# EAGLE design hsusb-ft232h-wing-bus-powered (EAGLE 5.10)
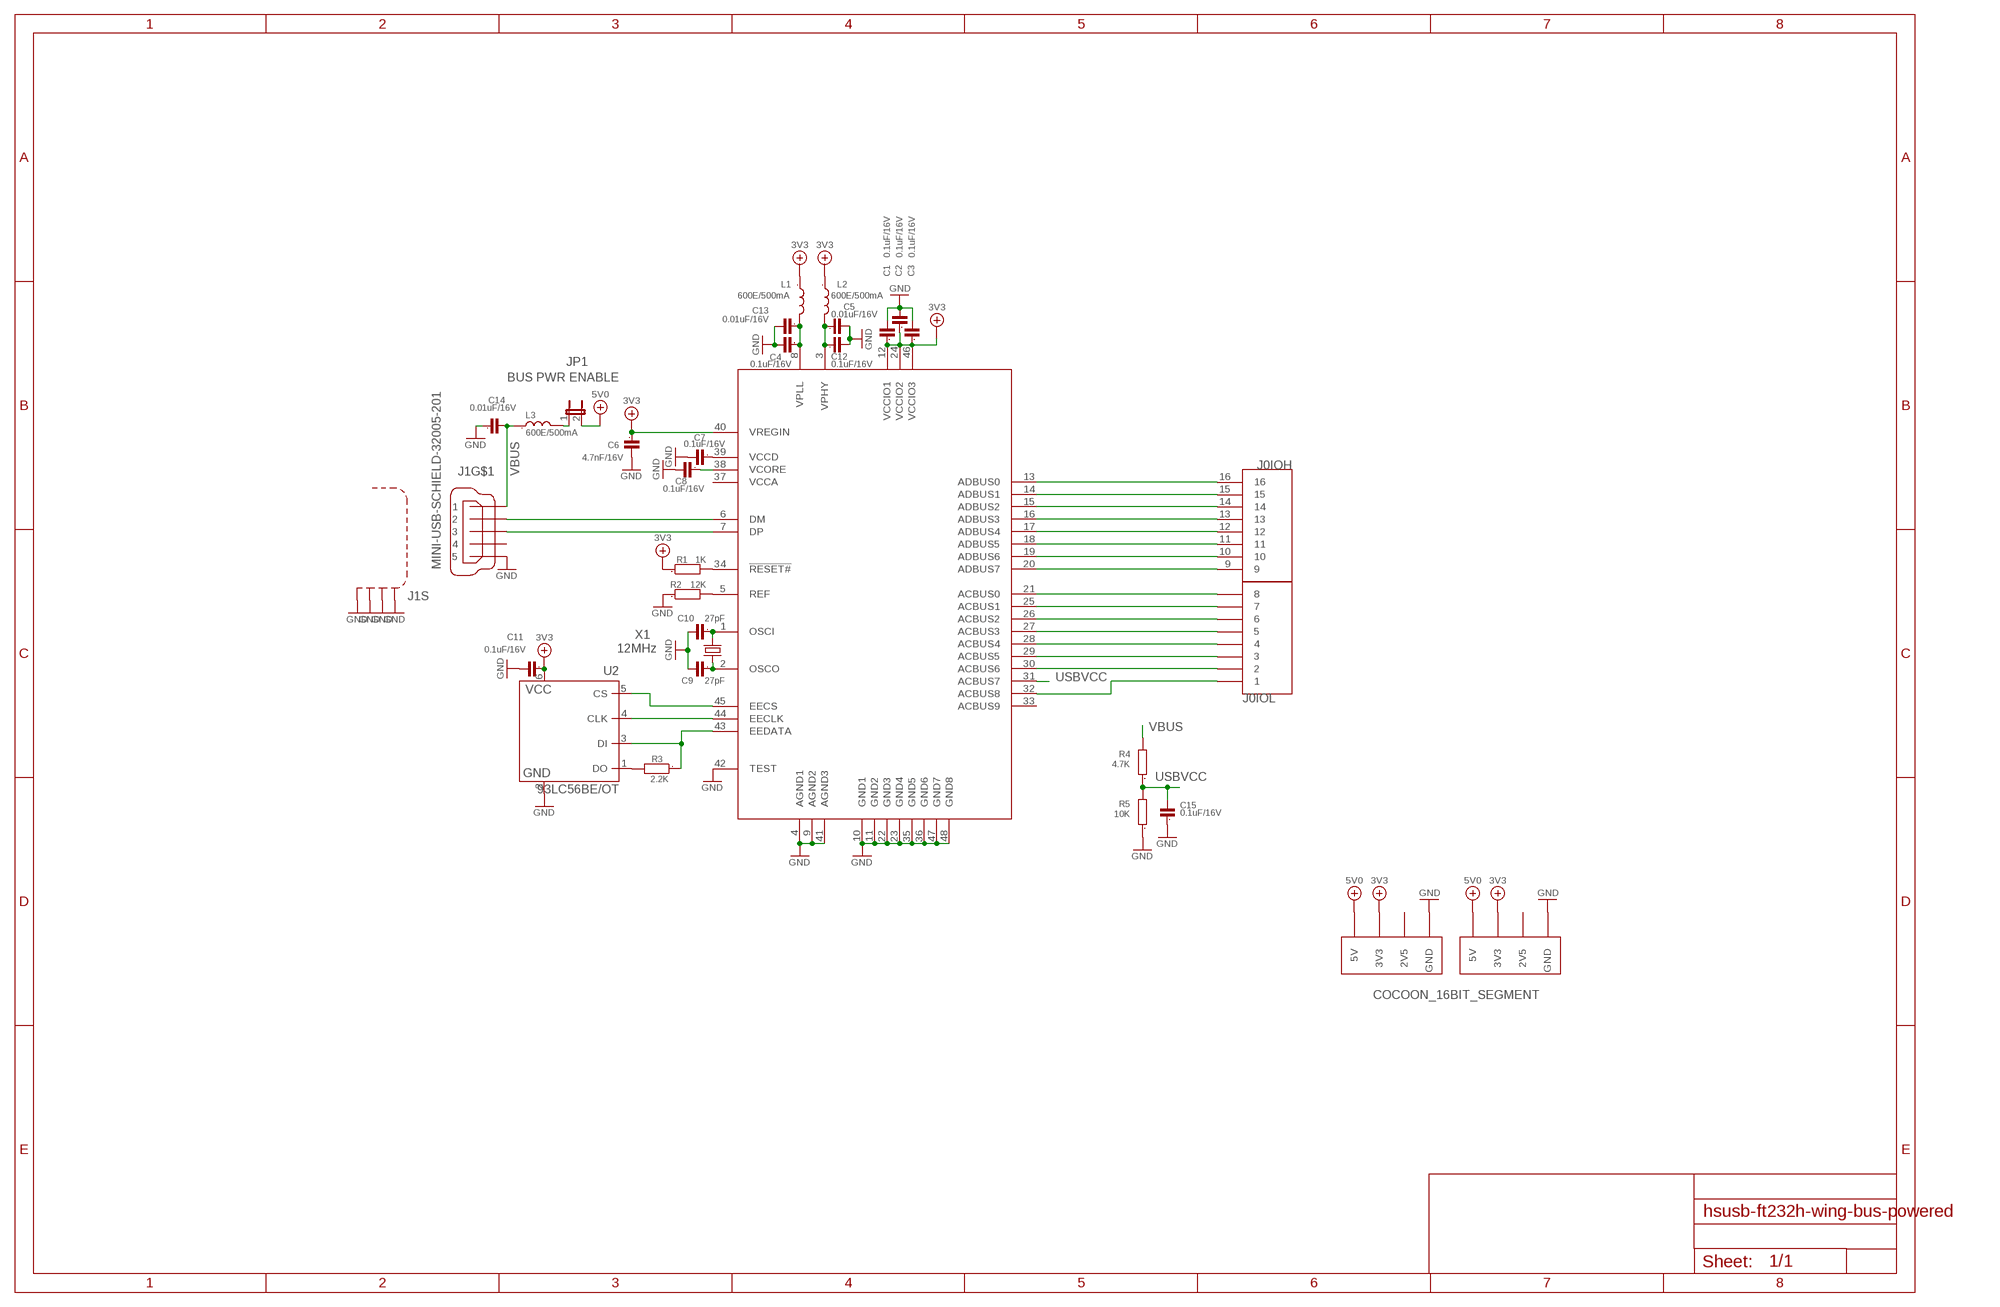
[diagram p0: schematic, sheet 1]

## Parts
C1  0.1uF/16V  C0603  [0603]
C2  0.1uF/16V  C0603  [0603]
C3  0.1uF/16V  C0603  [0603]
C4  0.1uF/16V  C0603  [0603]
C5  0.01uF/16V  C0603  [0603]
C6  4.7nF/16V  C0603  [0603]
C7  0.1uF/16V  C0603  [0603]
C8  0.1uF/16V  C0603  [0603]
C9  27pF  C0603  [0603]
C10  27pF  C0603  [0603]
C11  0.1uF/16V  C0603  [0603]
C12  0.1uF/16V  C0603  [0603]
C13  0.01uF/16V  C0603  [0603]
C14  0.01uF/16V  C0603  [0603]
C15  0.1uF/16V  C0603  [0603]
J0  COCOON_16BIT_SEGMENT  [COCOON_16BIT_SEGMENT]
J1  MINI-USB-SCHIELD-32005-201  [32005-201]
JP1  BUS PWR ENABLE  JP1E  [JP1]
L1  600E/500mA  L0805  [0805]
L2  600E/500mA  L0805  [0805]
L3  600E/500mA  L0805  [0805]
R1  1K  R0603  [0603]
R2  12K  R0603  [0603]
R3  2.2K  R0603  [0603]
R4  4.7K  R0603  [0603]
R5  10K  R0603  [0603]
U1  FT232HL  [LQFP48]
U2  93LC56BE/OT  [SOT23-6]
X1  12MHz  CRYSTALHC49S  [HC49/S]

## Nets
3V3: C1.1 C2.1 C3.1 C6.1 C11.1 J0.3V3(PWRH:3V3) J0.3V3_1(PWRL:3V3) L1.1 L2.1 R1.1 U1.12(VCCIO1) U1.24(VCCIO2) U1.40(VREGIN) U1.46(VCCIO3) U2.6(VCC)
5V0: J0.5V(PWRH:5V) J0.5V_1(PWRL:5V) JP1.2
GND: C1.2 C2.2 C3.2 C4.2 C5.2 C6.2 C7.2 C8.2 C9.2 C10.2 C11.2 C12.2 C13.2 C14.1 C15.1 J0.GND(PWRH:GND) J0.GND_1(PWRL:GND) J1.5 J1.M1(S:S1) J1.M2(S:S2) J1.M3(S:S3) J1.M4(S:S4) R2.1 R5.1 U1.4(AGND1) U1.9(AGND2) U1.10(GND1) U1.11(GND2) U1.22(GND3) U1.23(GND4) U1.35(GND5) U1.36(GND6) U1.41(AGND3) U1.42(TEST) U1.47(GND7) U1.48(GND8) U2.2(GND)
N$1 [HDUSB]: J1.2 U1.6(DM)
N$2 [HDUSB]: J1.3 U1.7(DP)
N$3: J0.9 U1.20(ADBUS7)
N$4: J0.10 U1.19(ADBUS6)
N$5: J0.11 U1.18(ADBUS5)
N$6: J0.12 U1.17(ADBUS4)
N$7: J0.13 U1.16(ADBUS3)
N$8: J0.14 U1.15(ADBUS2)
N$9: J0.15 U1.14(ADBUS1)
N$10: J0.16 U1.13(ADBUS0)
N$11: J0.1 U1.32(ACBUS8)
N$12: J0.2 U1.30(ACBUS6)
N$13: J0.3 U1.29(ACBUS5)
N$14: J0.4 U1.28(ACBUS4)
N$15: J0.5 U1.27(ACBUS3)
N$16: J0.6 U1.26(ACBUS2)
N$17: J0.7 U1.25(ACBUS1)
N$18: J0.8 U1.21(ACBUS0)
N$19: C4.1 C13.1 L1.2 U1.8(VPLL)
N$20: C5.1 C12.1 L2.2 U1.3(VPHY)
N$21: U1.45(EECS) U2.5(CS)
N$22: U1.44(EECLK) U2.4(CLK)
N$23: R3.1 U1.43(EEDATA) U2.3(DI)
N$24: JP1.1 L3.2
N$25: C7.1 U1.39(VCCD)
N$26: C8.1 U1.38(VCORE)
N$27: R3.2 U2.1(DO)
N$28: C10.1 U1.1(OSCI) X1.2
N$29: C9.1 U1.2(OSCO) X1.1
N$30: R1.2 U1.34(!RESET#)
N$31: R2.2 U1.5(REF)
USBVCC: C15.2 R4.1 R5.2 U1.31(ACBUS7)
VBUS: C14.2 J1.1 L3.1 R4.2
Unconnected: J1.4 U1.33(ACBUS9) U1.37(VCCA)

## Power pins joined to a net without a drawn wire
2V5: J0.2V5(PWRH:2V5) J0.2V5_1(PWRL:2V5)

## Library data of the parts
C1-C15 = GadgetFactory:C: CAPACITOR, European symbol
J0 = GadgetFactory_Pub6:COCOON_16BIT_SEGMENT
J1 = con-cypressindustries:MINI-USB-SCHIELD-: MINI USB-B Conector Source: www.cypressindustries.com
JP1 = usb1:JP1E: JUMPER
L1-L3 = GadgetFactory:L: INDUCTOR, European symbol
R1-R5 = GadgetFactory:R: RESISTOR, European symbol
U1 = usb1:FT232H
U2 = usb1:93LC56B
X1 = usb1:CRYSTAL: CRYSTAL

## Net classes
1 HDUSB: width 0.203 mm, clearance 0.635 mm

## Board
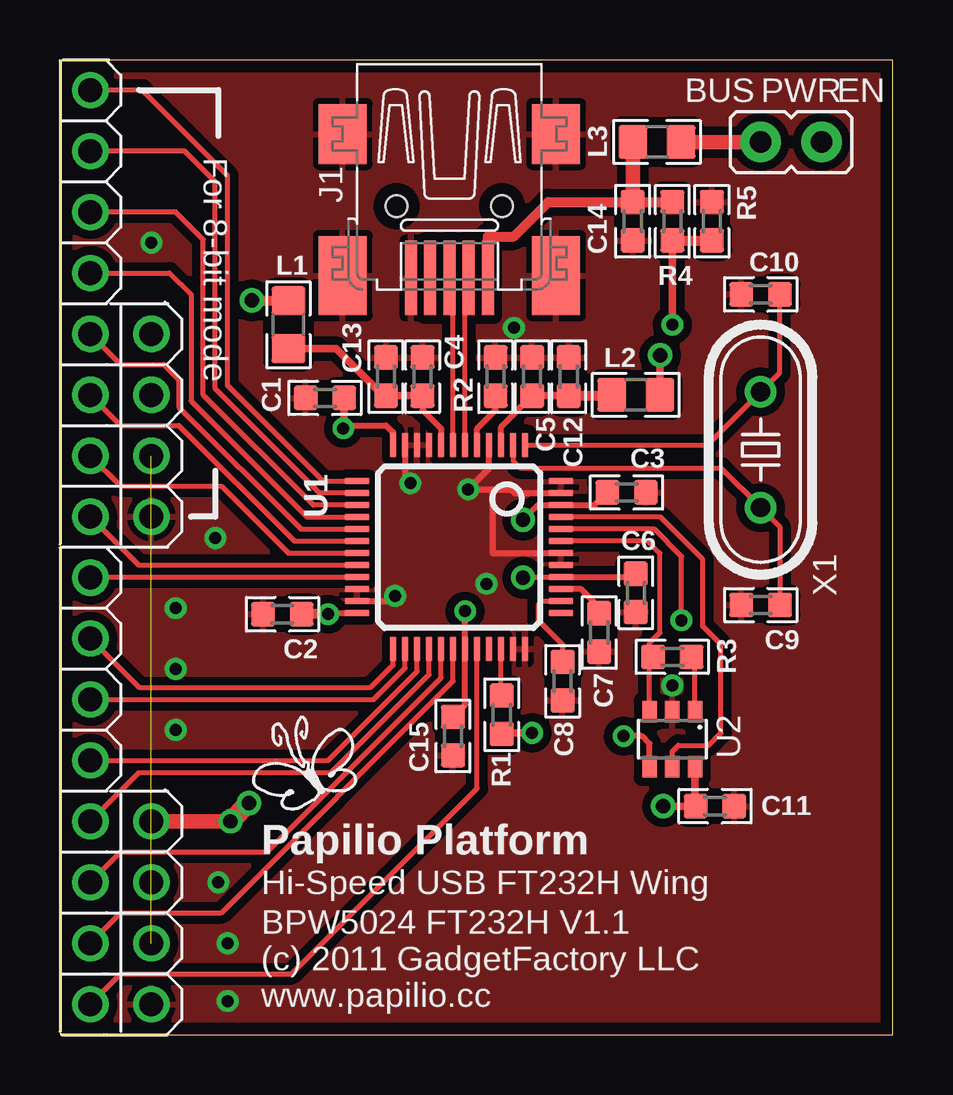
[diagram p1: board, top side]
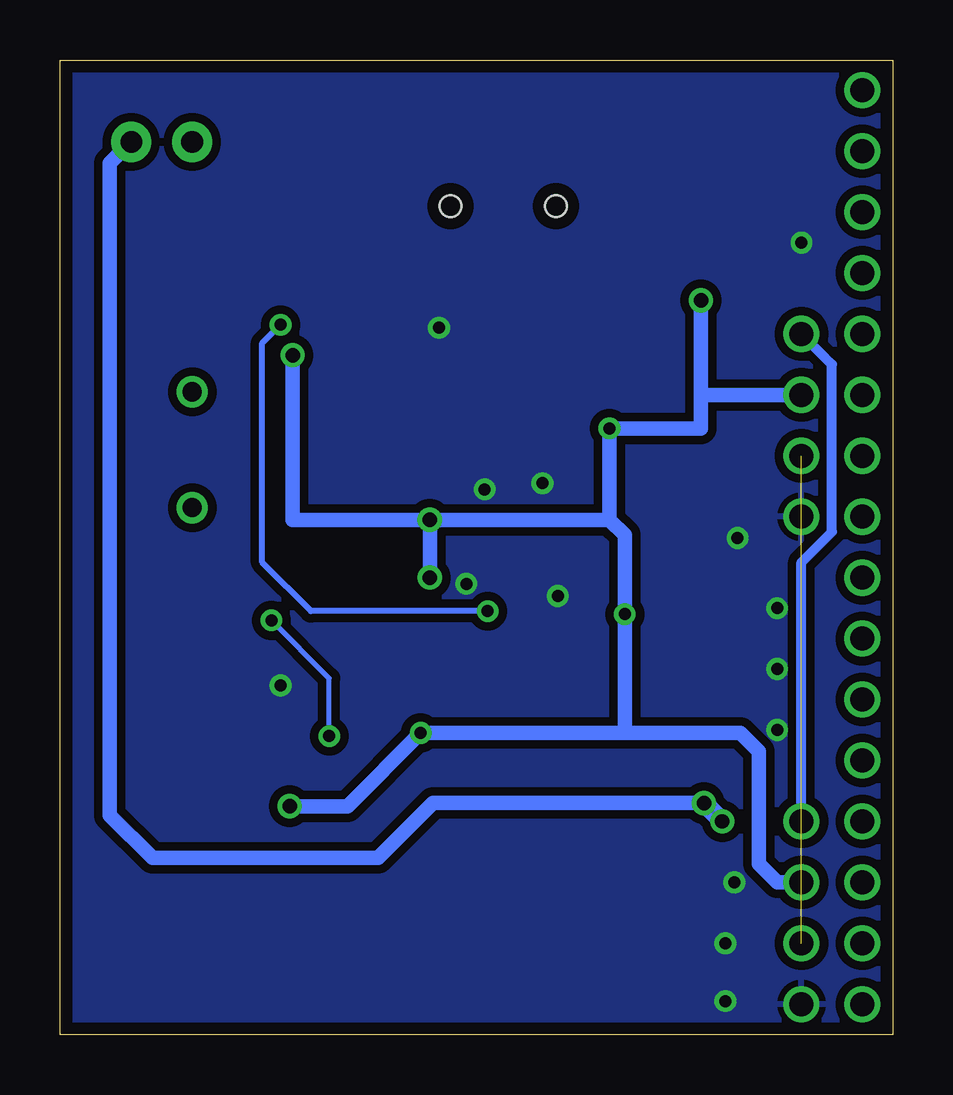
[diagram p2: board, bottom side, seen from below]

Size 34.72 x 40.63 mm. Coordinates in mm from the lower left corner, seen from the top.
Outline: 0,0 34.72,0 34.72,40.63 0,40.63 0,0
Copper layers (1*16): Top 0.035mm / dielectric 1.5mm / Bottom 0.035mm
Design rules "default *": minimum track width 8mil, minimum drill 19mil, track to track 8mil, track to pad 8mil, pad to pad 8mil, via to via 8mil, smd to smd 4mil, copper to edge 20mil, drill to drill 8mil, minimum pad ring 10mil, minimum via ring 8mil, stop-mask expansion 4mil, vias tented up to drill 24mil, thermal gap 10mil

### Footprints (pad centres in the part's own frame; a part is rotated, then mirrored left to right if it is on the bottom)
0603 = smd 1 x 1: 1 -0.8,0; 2 0.8,0
COCOON_16BIT_SEGMENT = drill 1 pad 1.422 round: 1 1.27,-19.05; 2 1.27,-16.51; 2V5 3.81,3.81; 2V5_1 3.81,-16.51; 3 1.27,-13.97; 3V3 3.81,6.35; 3V3_1 3.81,-13.97; 4 1.27,-11.43; 5 1.27,-8.89; 5V 3.81,8.89; 5V_1 3.81,-11.43; 6 1.27,-6.35; 7 1.27,-3.81; 8 1.27,-1.27; 9 1.27,1.27; 10 1.27,3.81; 11 1.27,6.35; 12 1.27,8.89; 13 1.27,11.43; 14 1.27,13.97; 15 1.27,16.51; 16 1.27,19.05; GND 3.81,1.27; GND_1 3.81,-19.05
32005-201 = smd 3.1 x 0.5: 1 3,1.6; 2 3,0.8; 3 3,0; 4 3,-0.8; 5 3,-1.6 | smd 2.5 x 2: M1 -3,-4.45; M2 -3,4.45 | smd 3.3 x 2: M3 2.9,4.45; M4 2.9,-4.45 | hole 0.9: 0,2.2; 0,-2.2
JP1 = drill 0.9 pad 1.676 round: 1 0,-1.27; 2 0,1.27
0805 = smd 1.2 x 1.4: 1 -1,0; 2 1,0
LQFP48 = smd 0.25 x 1: 1 -2.75,-4.25; 2 -2.25,-4.25; 3 -1.75,-4.25; 4 -1.25,-4.25; 5 -0.75,-4.25; 6 -0.25,-4.25; 7 0.25,-4.25; 8 0.75,-4.25; 9 1.25,-4.25; 10 1.75,-4.25; 11 2.25,-4.25; 12 2.75,-4.25; 25 2.75,4.25; 26 2.25,4.25; 27 1.75,4.25; 28 1.25,4.25; 29 0.75,4.25; 30 0.25,4.25; 31 -0.25,4.25; 32 -0.75,4.25; 33 -1.25,4.25; 34 -1.75,4.25; 35 -2.25,4.25; 36 -2.75,4.25 | smd 1 x 0.25: 13 4.25,-2.75; 14 4.25,-2.25; 15 4.25,-1.75; 16 4.25,-1.25; 17 4.25,-0.75; 18 4.25,-0.25; 19 4.25,0.25; 20 4.25,0.75; 21 4.25,1.25; 22 4.25,1.75; 23 4.25,2.25; 24 4.25,2.75; 37 -4.25,2.75; 38 -4.25,2.25; 39 -4.25,1.75; 40 -4.25,1.25; 41 -4.25,0.75; 42 -4.25,0.25; 43 -4.25,-0.25; 44 -4.25,-0.75; 45 -4.25,-1.25; 46 -4.25,-1.75; 47 -4.25,-2.25; 48 -4.25,-2.75
SOT23-6 = smd 0.6 x 0.9: 1 -0.95,-1.15; 2 0,-1.15; 3 0.95,-1.15; 4 0.95,1.15; 5 0,1.15; 6 -0.95,1.15
HC49/S = drill 0.8 round: 1 -2.413,0; 2 2.413,0

### Placement (x,y rotation side)
C1  11.05,26.54 180 top
C2  9.27,17.53 180 top
C3  23.62,22.61 0 top
C4  15.11,27.43 90 top
C5  19.68,27.43 90 top
C6  24,18.41 270 top
C7  22.48,16.76 270 top
C8  20.95,14.73 270 top
C9  29.21,17.91 180 top
C10  29.21,30.86 180 top
C11  27.3,9.53 0 top
C12  21.21,27.43 90 top
C13  13.59,27.43 90 top
C14  23.88,33.91 90 top
C15  16.38,12.45 90 top
DRILEGEND  [DRILEGEND]  -1.64,-5.63 0 top  (outside the outline)
J0  0,20.32 0 top
J1  16.24,34.54 270 top
JP1  30.48,37.21 270 top
L1  9.53,29.59 270 top
L2  24,26.67 180 top
L3  24.89,37.21 0 top
LOGO1  BUTTERFLY_LOGO  [BUTTERFLY_LOGO]  10.29,10.79 0 top
R1  18.41,13.34 90 top
R2  18.16,27.43 270 top
R3  25.53,15.75 0 top
R4  25.53,33.91 90 top
R5  27.18,33.91 270 top
U1  16.64,20.32 180 top
U2  25.53,12.32 180 top
X1  29.21,24.38 90 top

### Tracks (layer width: path | path; a pad name or v marks a point on that pad's centre or on a via)
2V5  (1 unrouted)
3V3  (via drill 0.5, 0.6)
  Top 0.203: U1.40 19.32,19.07 v19.3,19.05
  Top 0.254: U1.12 13.89,25.1 13.59,25.4 11.94,25.4 v11.81,25.27 | U1.24 11.22,17.57 v11.18,17.53 | C3.1 22.29,22.07 U1.46 19.91,22.07 v19.3,21.46 | U1.40 23.86,19.07 C6.1
  Top 0.305: C1.1 11.85,25.31 v11.81,25.27 | R1.1 18.38,12.57 v19.68,12.57 | v25.02,28.32 25.02,26.69 | U2.6 26.48,9.55 C11.1 v25.15,9.53
  Top 0.406: 25.02,26.69 L2.1 | v8,30.61 9.51,30.61 L1.1 | v11.18,17.53 C2.1
  Bottom 0.61: 8,26.67 J0.3V3 | 8,26.67 v8,30.61 | 8,26.67 8,25.27 v11.81,25.27 11.81,21.46 | J0.3V3_1 4.83,6.35 5.59,7.11 5.59,11.81 6.35,12.57 11.18,12.57 | 11.18,12.57 v19.68,12.57 22.73,9.53 v25.15,9.53 | 11.18,12.57 v11.18,17.53 11.18,20.83 11.81,21.46 | v19.3,21.46 v19.3,19.05 | v25.02,28.32 25.02,21.46 v19.3,21.46 | 11.81,21.46 v19.3,21.46
5V0  (via drill 0.6)
  Top 0.61: J0.5V_1 v7.11,8.89
  Top 0.813: 7.11,9.02 v7.11,8.89 v7.87,9.65
  Bottom 0.406: J0.5V_1 3.81,19.68 2.54,20.95 2.54,27.94 J0.5V
  Bottom 0.61: v7.87,9.65 19.18,9.65 21.46,7.37 30.86,7.37 32.64,9.14 32.64,36.32 JP1.2
  Bottom 0.813: v7.11,8.89 v7.87,9.65
GND  (via drill 0.5)
  Top 0.254: U1.23 13.75,18.07 v13.97,18.29 | U1.11 14.39,23.2 v14.61,22.99 | U1.47 18.96,22.57 18.8,22.73 v17.02,22.73 | U1.42 18.04,20.07 18.03,20.07 18.03,22.73 v17.02,22.73 | U1.4 17.89,23.6 v17.02,22.73
  other vias: 4.83,15.24 4.83,12.7 6.6,6.35 6.99,1.4 6.48,20.7 4.83,17.78 3.81,33.02 17.78,18.8 25.53,14.55 6.99,3.81 18.92,29.46
  pour Top (isolate 0.356, rank 3): 0,0 34.8,0.13 34.8,40.77 0,40.64
  pour Bottom (isolate 0.356): 0,0 34.8,0 34.8,40.64 0,40.64
N$1
  Top 0.203: U1.6 16.89,31.39 J1.2
N$2
  Top 0.203: U1.7 16.39,31.39 J1.3
N$3
  Top 0.203: U1.20 3.29,19.57 J0.9
N$4
  Top 0.203: J0.10 2.54,22.86 6.73,22.86 9.52,20.07 U1.19
N$5
  Top 0.203: U1.18 9.78,20.57 4.95,25.4 2.54,25.4 J0.11
N$6
  Top 0.203: J0.12 2.54,27.94 4.32,27.94 4.95,27.3 4.95,26.16 10.04,21.07 U1.17
N$7
  Top 0.203: J0.13 4.57,31.75 5.46,30.86 5.46,26.42 10.31,21.57 U1.16
N$8
  Top 0.203: J0.14 4.83,34.29 5.97,33.15 5.97,26.67 10.57,22.07 U1.15
N$9
  Top 0.203: U1.14 10.83,22.57 6.48,26.92 6.48,35.56 5.21,36.83 J0.15
N$10
  Top 0.203: U1.13 10.97,23.07 6.99,27.05 6.99,35.81 3.43,39.37 J0.16
N$11
  Top 0.203: J0.1 2.54,2.54 9.65,2.54 17.39,10.28 U1.32
N$12
  Top 0.203: J0.2 2.54,5.08 6.73,5.08 16.39,14.74 U1.30
N$13
  Top 0.203: J0.3 2.54,7.62 8.64,7.62 15.89,14.87 U1.29
N$14
  Top 0.203: U1.28 15.39,15.01 11.3,10.92 3.3,10.92 J0.4
N$15
  Top 0.203: J0.5 11.18,11.43 14.89,15.14 U1.27
N$16
  Top 0.203: J0.6 13.08,13.97 14.39,15.28 U1.26
N$17
  Top 0.203: U1.25 13.89,15.41 12.95,14.48 3.3,14.48 J0.7
N$18
  Top 0.203: U1.21 1.29,19.07 J0.8
N$19
  Top 0.254: C4.1 15.11,26.04 15.89,25.26 U1.8
  Top 0.305: C4.1 C13.1 13.46,26.63 11.5,28.59 L1.2
N$20
  Top 0.254: U1.3 18.39,25.33 C5.1
  Top 0.305: C5.1 C12.1
  Top 0.406: C12.1 22.96,26.63 L2.2
N$21
  Top 0.203: U1.45 25.04,21.57 26.8,19.81 26.8,17.02 27.56,16.26 27.56,12.57 27.05,12.06 25.78,12.06 25.53,11.81 U2.5
N$22  (via drill 0.5)
  Top 0.203: U1.44 24.78,21.07 25.91,19.94 v25.91,17.27 | U2.4
  Top 0.254: v23.5,12.45 24.26,12.45 24.58,12.13 U2.4
  Bottom 0.203: v23.5,12.45 23.5,14.86 v25.91,17.27
N$23
  Top 0.203: U1.43 24.52,20.57 25.02,20.07 25.02,16.76 24.58,16.32 24.58,15.6 U2.3
  Top 0.305: 24.58,15.6 R3.1
N$24
  Top 0.61: L3.2 JP1.1
N$25
  Top 0.254: U1.39 21.73,18.57 22.48,17.82 C7.1
N$26
  Top 0.203: C8.1 20.95,16.26 19.94,17.27 19.94,17.91 20.1,18.07 U1.38
N$27
  Top 0.203: U2.1 26.48,15.6
  Top 0.305: 26.48,15.6 R3.2
N$28
  Top 0.203: U1.1 26.98,24.57 X1.2 30.01,27.6 C10.1
N$29
  Top 0.203: U1.2 18.89,23.91 19.18,23.62 27.56,23.62 X1.1 30.01,21.17 C9.1
N$30
  Top 0.203: U1.34 18.39,14.16 R1.2
N$31
  Top 0.254: R2.2 18.16,26.04 17.39,25.26 U1.5
USBVCC  (via drill 0.5)
  Top 0.254: U1.31 v16.89,17.65 | U1.31 | U1.31 16.89,13.75 C15.2
  Top 0.305: v25.53,29.59 R4.1
  Top 0.406: R4.1 R5.2
  Bottom 0.254: v25.53,29.59 26.29,28.83 26.29,19.68 24.26,17.65 v16.89,17.65
VBUS
  Top 0.406: C14.2 R4.2 | C14.2 23.89,34.71 | C14.2 20.36,34.71 18.92,33.27 17.84,33.27 J1.1
  Top 0.61: 23.89,34.71 L3.1

### Text on the board
tPlace: BUS | PWR | EN | For 8-bit mode | Papilio Platform | Hi-Speed USB FT232H Wing | BPW5024 FT232H V1.1 | (c) 2011 GadgetFactory LLC | www.papilio.cc